# Altium schematic sheet MCU.SchDoc
size 431 x 279 mm; SheetNumber: 1; SheetTotal: 3
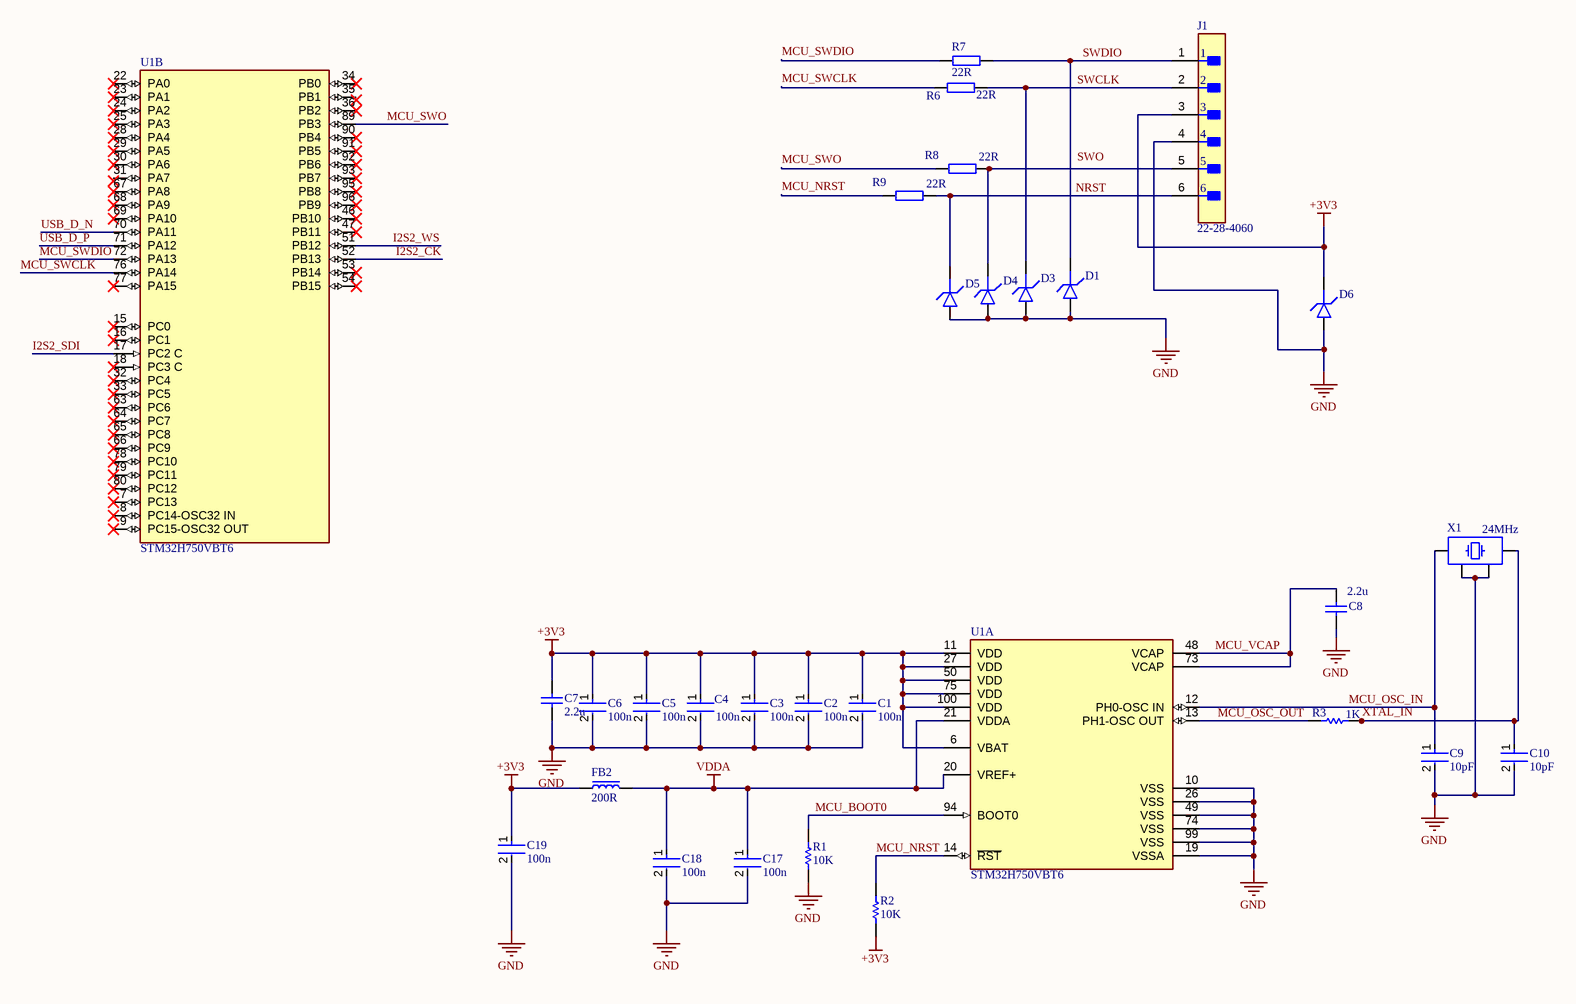
[diagram p0: MCU.SchDoc]

## Parts
C1  100n  [FP-C0402-BB-MFG]
C2  100n  [FP-C0402-BB-MFG]
C3  100n  [FP-C0402-BB-MFG]
C4  100n  [FP-C0402-BB-MFG]
C5  100n  [FP-C0402-BB-MFG]
C6  100n  [FP-C0402-BB-MFG]
C7  2.2u  [CAPC1608X90X35NL15T15]
C8  2.2u  [CAPC1608X90X35NL15T15]
C9  10pF  [FP-C0402-BB-MFG]
C10  10pF  [FP-C0402-BB-MFG]
C17  100n  [FP-C0402-BB-MFG]
C18  100n  [FP-C0402-BB-MFG]
C19  100n  [FP-C0402-BB-MFG]
D1  (no value)  [D_0402]
D3  (no value)  [D_0402]
D4  (no value)  [D_0402]
D5  (no value)  [D_0402]
D6  (no value)  [D_0402]
FB2  200R  [FB_0603]
J1  22-28-4060  [FP-22-28-4060-MFG]
R1  10K  [RESC1005X40X25ML05T05]
R2  10K  [RESC1005X40X25ML05T05]
R3  1K  [RESC1005X40X25NL05T05]
R6  22R  [RES_0402]
R7  22R  [RES_0402]
R8  22R  [RES_0402]
R9  22R  [RES_0402]
U1  STM32H750VBT6  [FP-LQFP100-1L-MFG]  (parts A,B of 3)
X1  24MHz  [XTAL_3225]

## Nets
+3V3: C1.1 C2.1 C3.1 C4.1 C5.1 C6.1 C7.2 C19.1 D6.K FB2.1 J1.3 R2.1 U1.6(VBAT) U1.11(VDD) U1.27(VDD) U1.50(VDD) U1.75(VDD) U1.100(VDD)
GND: C1.2 C2.2 C3.2 C4.2 C5.2 C6.2 C7.1 C8.2 C9.2 C10.2 C17.2 C18.2 C19.2 D1.A D3.A D4.A D5.A D6.A J1.4 R1.1 U1.10(VSS) U1.19(VSSA) U1.26(VSS) U1.49(VSS) U1.74(VSS) U1.99(VSS) X1.2 X1.4
VDDA: C17.1 C18.1 FB2.2 U1.20(VREF+) U1.21(VDDA)
I2S2_CK: U1.52(PB13)
I2S2_SDI: U1.17(PC2_C)
I2S2_WS: U1.51(PB12)
MCU_BOOT0: R1.2 U1.94(BOOT0)
MCU_NRST: R2.2 R9.1 U1.14(~{RST})
MCU_OSC_IN: C9.1 U1.12(PH0-OSC_IN) X1.1
MCU_OSC_OUT: R3.1 U1.13(PH1-OSC_OUT)
MCU_SWCLK: R6.1 U1.76(PA14)
MCU_SWDIO: R7.1 U1.72(PA13)
MCU_SWO: R8.1 U1.89(PB3)
MCU_VCAP: C8.1 U1.48(VCAP) U1.73(VCAP)
NRST: D5.K J1.6 R9.2
SWCLK: D3.K J1.2 R6.2
SWDIO: D1.K J1.1 R7.2
USB_D_N: U1.70(PA11)
USB_D_P: U1.71(PA12)
XTAL_IN: C10.1 R3.2 X1.3
NetD4_K: D4.K J1.5 R8.2

Not connected (* = marked no-connect by the designer): U1 7(PC13)* 8(PC14-OSC32_IN)* 9(PC15-OSC32_OUT)* 15(PC0)* 16(PC1)* 18(PC3_C)* 22(PA0)* 23(PA1)* 24(PA2)* 25(PA3)* 28(PA4)* 29(PA5)* 30(PA6)* 31(PA7) 32(PC4)* 33(PC5)* 34(PB0)* 35(PB1) 36(PB2)* 46(PB10)* 47(PB11)* 53(PB14)* 54(PB15)* 63(PC6)* 64(PC7)* 65(PC8)* 66(PC9)* 67(PA8)* 68(PA9)* 69(PA10)* 77(PA15)* 78(PC10)* 79(PC11)* 80(PC12)* 90(PB4)* 91(PB5)* 92(PB6)* 93(PB7)* 95(PB8)* 96(PB9)*

## Notes on the sheet
- Labels drawn without touching a wire or pin: SWO
- DWG. NO.
- REV.
- SHT.
- THIS DOCUMENT AND THE DATA DISCLOSED HEREIN OR HEREWITH IS THE PROPERTY OF ALTIUM LIMITED AND MAY BE FREELY DISTRIBUTED IN WHOLE. NO RIGHTS ARE RESERVED OR EXPRESS OR IMPLIED WARANTEE GIVEN.
- REVISION
- DESCRIPTION
- DATE
- APPROVED
- ENG:
- APPROVALS
- PROJECT
- DSN:
- CHK:
- REFERENCE DOCUMENTS
- PROJECT REVISION:
- TITLE
- DOCUMENT REVISION:
- DESIGN ITEM:
- BOM:
- FAB DWG:
- PCB DWG:
- ASSY DWG:
- SCALE:
- SIZE
- B
- CAGE CODE
- FILE NAME
- DWG NO.
- SHEET
- OF
- REV

## Library data of the parts
C1-C6 C17-C19 = CMP-03020-006638-2: C0402 0.10 μF X7R 5.00% 16 V; Manufacturer: Kemet; Manufacturer Part Number: C0402C104J4RAC; Material: Ceramic; Capacitance: 0.10 μF; Tolerance: 0.05; Voltage Rating: 16 V; Temperature Coefficient: 15%; Value: 0.10 μF; Device Class L1: Passive Components; Temperature: -55°C to +125°C; Temperature Characteristic: X7R; Octopart: https://octopart.com/c0402c104j4rac-kemet-24931384; Package: C0402-BB; ComponentLink2URL: https://content.kemet.com/datasheets/KEM_C1002_X7R_SMD.pdf; Lead Free: Yes; Ipc Land Pattern Name: CAPC10050X50; RoHS: TRUE; Automotive: No; Mouser Description: Capacitor, Ceramic, 100nF, 16VDC, 5-% Tol, 5+% Tol, X7R-TC Code, -15, 15%-TC; Category: Cap; ComponentLink2Description: Datasheet; Temperature Range Low: -55°C; Height: 0.55mm; Device Class L2: Capacitors; Temperature Range High: +125°C; Device Class L3: Ceramic Capacitors
C7 C8 = CMP-1035-02765-2: Manufacturer: Kemet; Part Number: C0603C225M4PACTU
C9 C10 = CMP-2008-03377-2: CAP CER 10PF 16V NP0 0402; Manufacturer Part Number: C0402C100J4GACTU; Manufacturer: Kemet; Material: Ceramic; Temperature Coefficient: 15%; Temperature Characteristic: C0G; Tolerance: 0.05; Device Class L1: Passive Components; Automotive: No; Device Class L2: Capacitors; Category: Cap; Voltage Rating: 16 V; Digikey Description: CAP CER 10PF 16V NP0 0402; Value: 10 pF; Device Class L3: Ceramic Capacitors; Mouser Description: Capacitor, Ceramic, 10Pf, 16Vdc, 5-% Tol, 5+% Tol, C0g-Tc Code, -30, 30Ppm-Tc Rohs Compliant: Yes; Lead Free: Yes; RoHS: TRUE; ComponentLink2URL: https://content.kemet.com/datasheets/KEM_C1002_X7R_SMD.pdf; Temperature: -55°C to +125°C; Height: 0.55mm; ComponentLink2Description: Datasheet; Ipc Land Pattern Name: CAPC10050X50; Package: C0402-BB; Temperature Range High: +125°C; Capacitance: 10 pF; Octopart: https://octopart.com/c0402c100j4gactu-kemet-17536146; Temperature Range Low: -55°C
D1 D3-D6 = D_TVS_0402: Diode TVS / ESD 0402
FB2 = FB_0603: Ferrite Bead SMD 0603; Manufacturer: *; Manufacturer Part Number: *; Distributor Link: *; LCSC: *
J1 = CMP-04776-000763-1: CONN HEADER VERT 6POS 2.54MM; Voltage Rating: 250V; Current Rating: 4A; Number of Contacts: 6; Max Voltage Rating (DC): 250.25kV; Gender: Male; Contact Resistance: 20mR; Connector Type: Male Pin; Color: Black; Max Voltage Rating (AC): 250V; Pitch: 2.54mm; Orientation: Straight; Max Operating Temperature: 75°C; Contact Plating: Tin; Depth: 2.49mm; Contact Type: Male Pin; Number of Positions: 6; Length: 15.24mm; Packaging: Bulk; Mount: Through Hole; Housing Material: Thermoplastic; Housing Color: Black; Termination: Solder; Contact Material: Brass; Min Operating Temperature: 0°C; Series: KK® 42375; Number of Rows: 1; Package Quantity: 1; RoHS Compliant: Yes; Contact Mating Length: 0.24inch
R1 R2 = CMP-2002-00433-1: Part Number: ERJ-2GEJ103X; Manufacturer: Panasonic
R3 = CMP-2002-00432-1: Manufacturer: Panasonic; Part Number: ERJ-2GEJ102X
R6-R9 = RES_0402: Resistor SMD 0402; Manufacturer: *; Manufacturer Part Number: *; Distributor Link: *; LCSC: *
U1 = CMP-12105-000017-1: IC MCU 32BIT 128KB FLASH 100LQFP; Manufacturer: STMicroelectronics; Number Of Uart Channels: 9; Number Of I/Os: 82; Max Junction Temp: +125°C; Data Bus Width: 32bits; Ram Size: 1MBytes; Min Supply Voltage: 1.62V; Number Of Spi Channels: 6; Number Of Adc Channels: 36; Max Supply Voltage: 3.6V; Standoff Height: 0.05mm; Interface: I2C,SPI,UART,USART,CAN,USB,LIN,IrDA,Ethernet,I2S,Other; Number Of A/D Converters: 3; Number Of I2C Channels: 4; Memory Size: 128KBytes; Frequency: 480MHz; Number Of Timers/Counters: 20; Number Of Ethernet Channels: 1; Core Architecture: ARM Cortex-M7; Number Of Usb Channels: 2; Number Of Pwm Channels: 42; Ambient Temperature Range High: +85°C; Temperature: -40°C to +125°C; ComponentLink2URL: https://www.st.com/resource/en/datasheet/stm32h750vb.pdf; Device Class L2: Embedded Processors and Controllers; Temperature Range Low: -40°C; Octopart: https://octopart.com/stm32h750vbt6-stmicroelectronics-94048547; Category: IC; Manufacturer Part Number: STM32H750VBT6; Height: 1.6mm; Lead Free: Yes; Device Class L1: Integrated Circuits (ICs); Digikey Description: IC MCU 32BIT 128KB FLASH 100LQFP; RoHS: TRUE; Ambient Temperature Range Low: -40°C; Device Class L3: Microcontrollers; ComponentLink2Description: Datasheet; Mouser Description: MCU 32-Bit STM32H750VB ARM Cortex M7 RISC 128KB Flash 1.8V/2.5V/3.3V 100-Pin LQFP Tray; Number Of Cores: 1; Automotive: No; Memory Type: FLASH; Package: LQFP100-1L; Temperature Range High: +125°C
X1 = TSX-3225_24.0000MF15X-AC: Crystal SMD 24MHz 10PPM 7pF 3225; Manufacturer: Epson; Manufacturer Part Number: TSX-3225 24.0000MF15X-AC